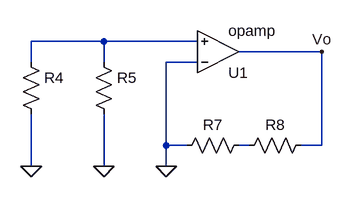
[diagram p0: schematic Draft2.asc]
Draft2.asc, the LTspice schematic file:
Version 4
SHEET 1 880 680
WIRE 64 16 -48 16
WIRE 208 16 64 16
WIRE 400 32 272 32
WIRE -48 48 -48 16
WIRE 64 48 64 16
WIRE 208 48 160 48
WIRE 160 176 160 48
WIRE 192 176 160 176
WIRE 288 176 272 176
WIRE 400 176 400 32
WIRE 400 176 368 176
WIRE -48 208 -48 128
WIRE 64 208 64 128
WIRE 160 208 160 176
FLAG 160 208 0
FLAG -48 208 0
FLAG 64 208 0
FLAG 400 32 Vo
SYMBOL Opamps\\opamp 240 96 M180
SYMATTR InstName U1
SYMBOL res 48 32 R0
SYMATTR InstName R5
SYMATTR Value ""
SYMBOL res -64 32 R0
SYMATTR InstName R4
SYMATTR Value ""
SYMBOL res 288 160 R90
WINDOW 0 0 56 VBottom 2
WINDOW 3 32 56 VTop 2
SYMATTR InstName R7
SYMATTR Value ""
SYMBOL res 384 160 R90
WINDOW 0 0 56 VBottom 2
WINDOW 3 32 56 VTop 2
SYMATTR InstName R8
SYMATTR Value ""

The netlist it stands for:
* Draft2.asc
XU1 0 N001 Vo opamp Aol=100K GBW=10Meg  ; pins invin noninvin out
R5 N001 0
R4 N001 0
R7 N002 0
R8 Vo N002
.backanno
.end